# EAGLE design pcb (EAGLE 9.6.2)
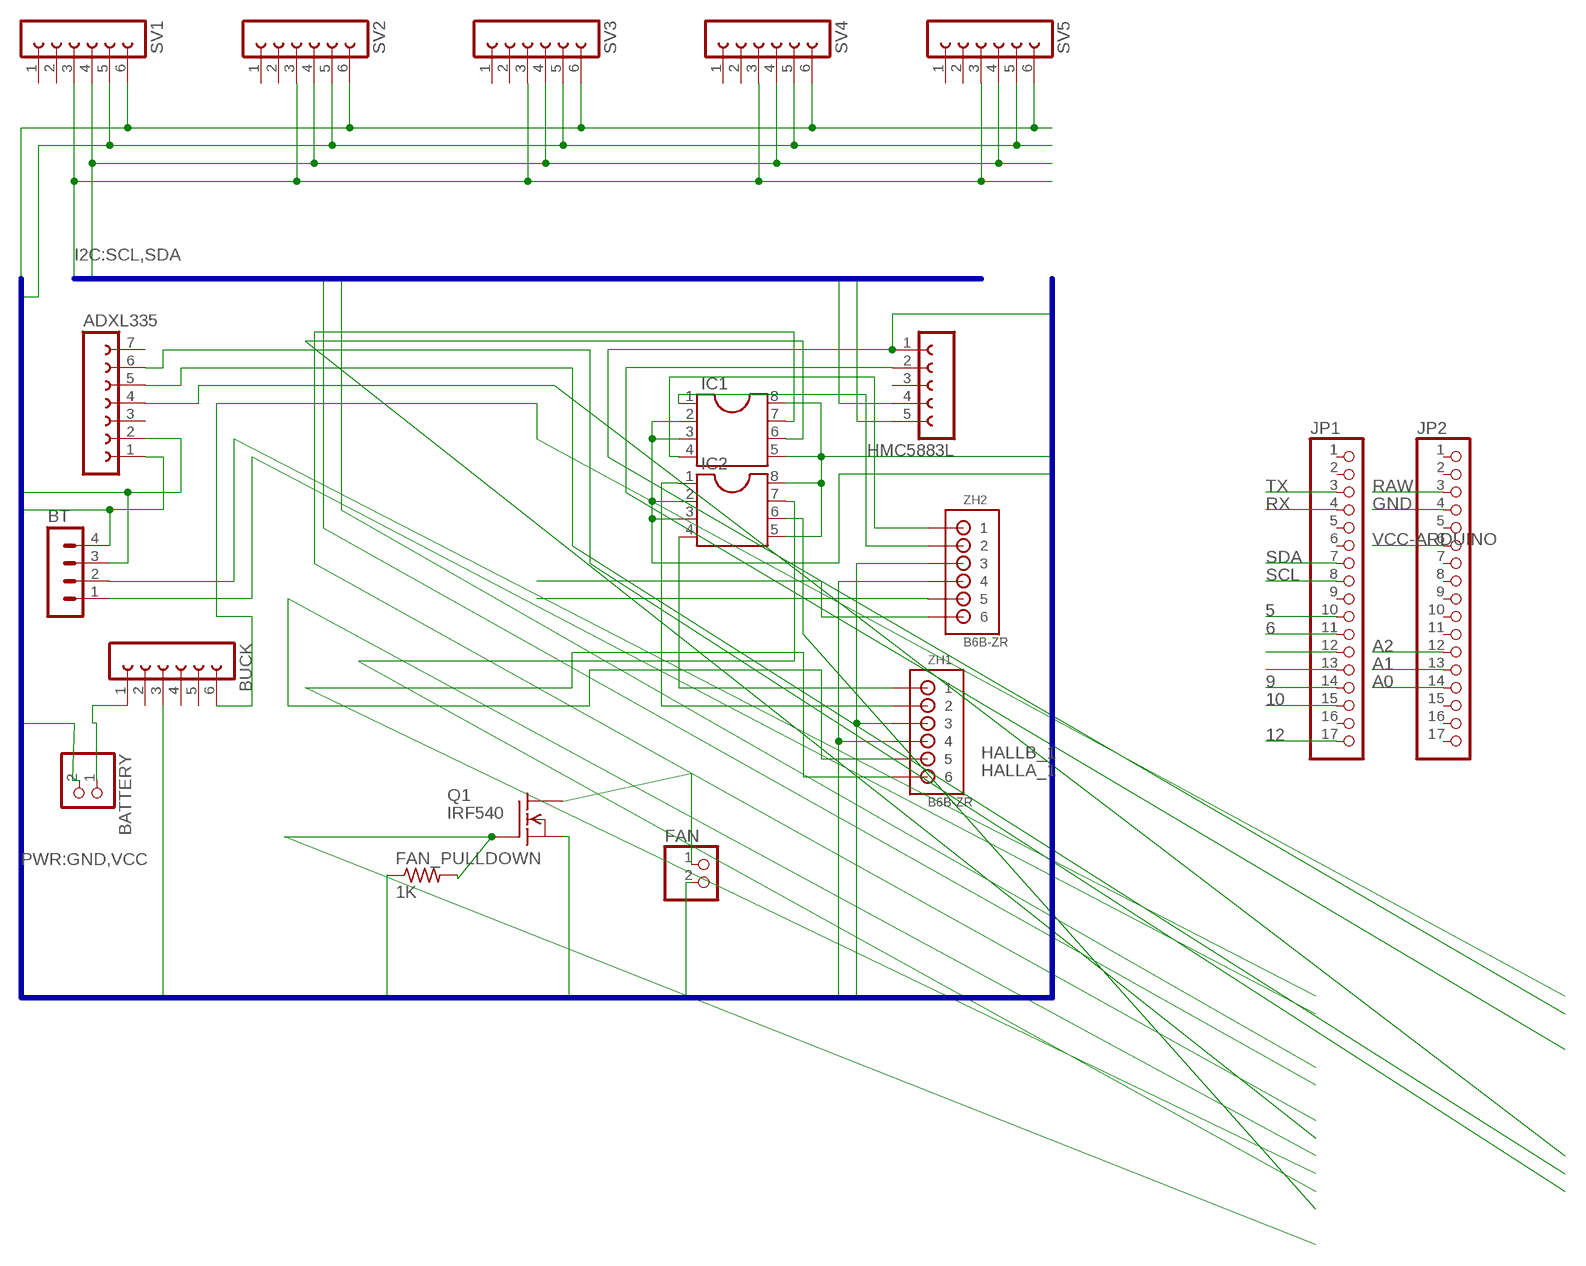
[diagram p0: schematic, sheet 1]

## Parts
ADXL335  FE07-1  [FE07]
BATTERY  PINHD-1X2  [1X02]
BT  MA04-1  [MA04-1]
BUCK  FE06-1  [FE06]
FAN  PINHD-1X2  [1X02]
FAN_PULLDOWN  1K  R-US_0207/10  [0207/10]
HMC5883L  FE05-1  [FE05-1]
IC1  DIL8S  [SOCKET-08]
IC2  DIL8S  [SOCKET-08]
JP1  PINHD-1X17  [1X17]
JP2  PINHD-1X17  [1X17]
Q1  IRF540  [TO220]
SV1  FE06-1  [FE06]
SV2  FE06-1  [FE06]
SV3  FE06-1  [FE06]
SV4  FE06-1  [FE06]
SV5  FE06-1  [FE06]
ZH1  B6B-ZR  [B6B-ZR]
ZH2  B6B-ZR  [B6B-ZR]

## Nets
5: IC1.7 JP1.10
6: IC1.6 JP1.11
9: IC2.7 JP1.14
10: IC2.6 JP1.15
12: FAN_PULLDOWN.2 JP1.17 Q1.1(G)
A0: ADXL335.6 JP2.14
A1: ADXL335.5 JP2.13
A2: ADXL335.4 JP2.12
GND: ADXL335.2 BATTERY.2 BT.3 BUCK.3 FAN_PULLDOWN.1 HMC5883L.1 IC1.5 IC1.8 IC2.5 IC2.8 JP2.4 Q1.3(S) SV1.5 SV2.5 SV3.5 SV4.5 SV5.5 ZH1.4 ZH2.4
HALLA_1: JP1.13 ZH1.6
HALLB_1: JP1.12 ZH1.5
N$7: BATTERY.1 BUCK.1
N$11: ZH2.5
N$12: ZH2.6
N$13: IC1.1 ZH2.2
N$14: IC1.4 ZH2.1
N$15: IC2.4 ZH1.1
N$16: IC2.1 ZH1.2
N$18: FAN.1 Q1.2(D)
RAW: BUCK.6 JP2.3
RX: BT.1 JP1.4
SCL: HMC5883L.4 JP1.8 SV1.4 SV2.4 SV3.4 SV4.4 SV5.4
SDA: HMC5883L.5 JP1.7 SV1.3 SV2.3 SV3.3 SV4.3 SV5.3
TX: BT.2 JP1.3
VCC: ADXL335.1 BT.4 FAN.2 IC1.2 IC1.3 IC2.2 IC2.3 SV1.6 SV2.6 SV3.6 SV4.6 SV5.6 ZH1.3 ZH2.3
VCC-ARDUINO: HMC5883L.2 JP2.6
Unconnected: ADXL335.3 ADXL335.7 BUCK.2 BUCK.4 BUCK.5 HMC5883L.3 JP1.1 JP1.2 JP1.5 JP1.6 JP1.9 JP1.16 JP2.1 JP2.2 JP2.5 JP2.7 JP2.8 JP2.9 JP2.10 JP2.11 JP2.15 JP2.16 JP2.17 SV1.1 SV1.2 SV2.1 SV2.2 SV3.1 SV3.2 SV4.1 SV4.2 SV5.1 SV5.2

## Buses
I2C:SCL,SDA
PWR:GND,VCC

## Library data of the parts
ADXL335 = con-lsta:FE07-1: FEMALE HEADER; OC_FARNELL: unknown; OC_NEWARK: unknown
BATTERY FAN = pinhead:PINHD-1X2: PIN HEADER
BT = con-lstb:MA04-1: PIN HEADER; OC_FARNELL: unknown; OC_NEWARK: unknown
BUCK SV1-SV5 = con-lsta:FE06-1: FEMALE HEADER; OC_FARNELL: unknown; OC_NEWARK: unknown
FAN_PULLDOWN = rcl:R-US_: RESISTOR, American symbol; SPICEPREFIX: R
HMC5883L = con-lsta:FE05-1: FEMALE HEADER; OC_FARNELL: unknown; OC_NEWARK: unknown
IC1 IC2 = ic-package:DIL8: Dual In Line / Socket
JP1 JP2 = pinhead:PINHD-1X17: PIN HEADER
Q1 = transistor-fet:IRF540: N-Channel Enhancement MOSFET (HEXFET); 100V; 28A; 0,077Ohm
ZH1 ZH2 = JST ZH:B6B-ZR: JST-ZH Connector 6 pol, 1.5mm pitch Package: B6B-ZR Source: http://www.jst-mfg.com/product/pdf/eng/eZH.pdf

## Board
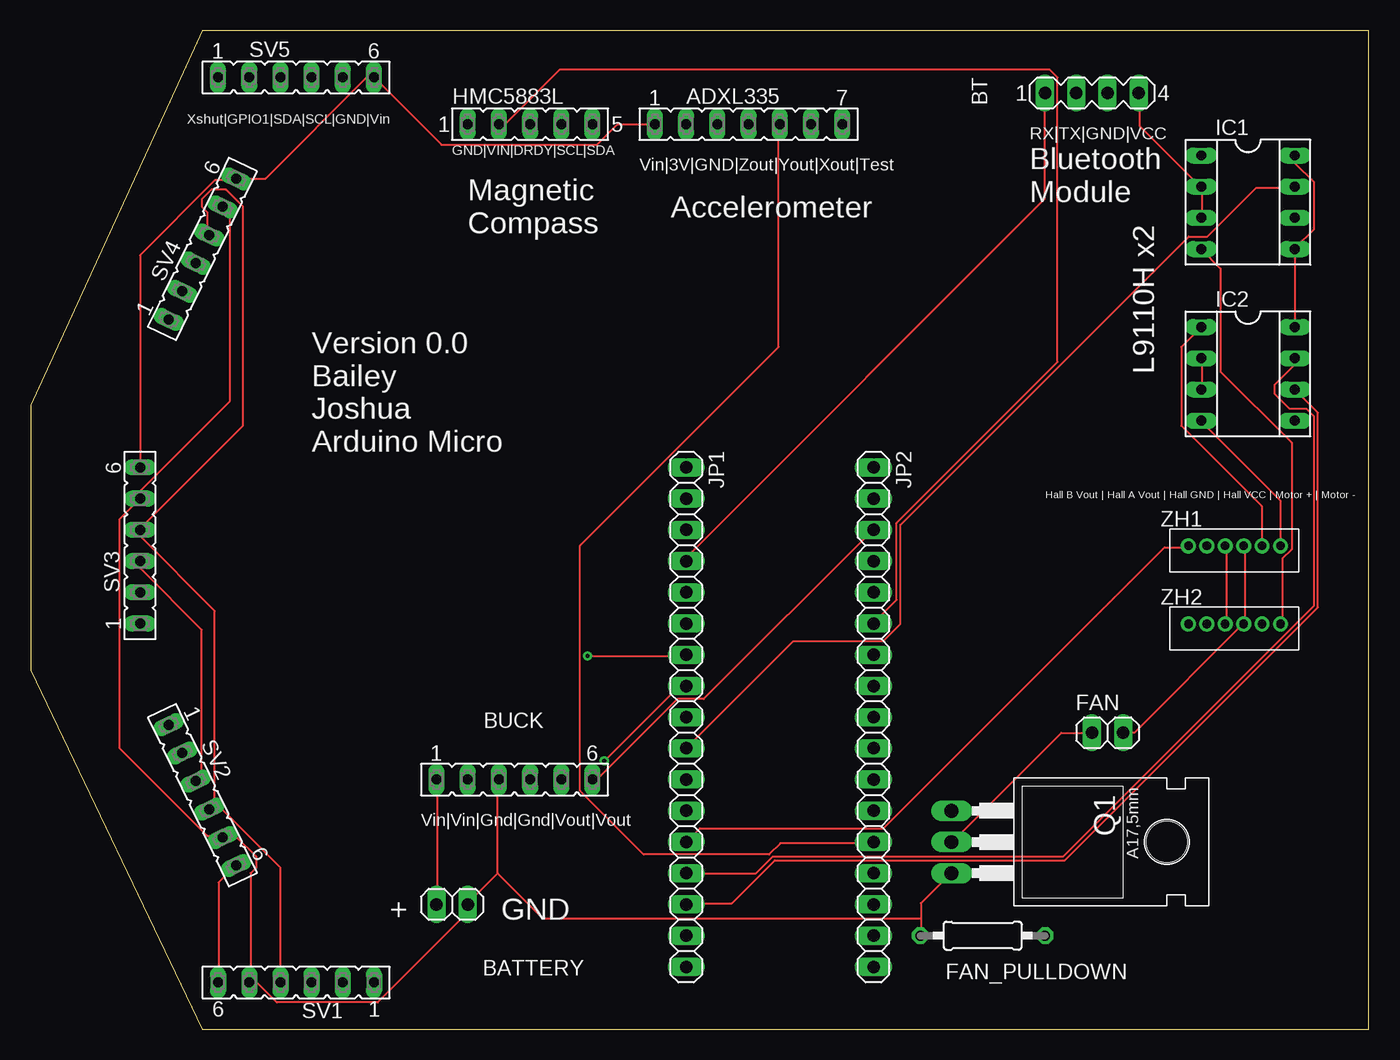
[diagram p1: board, top side]
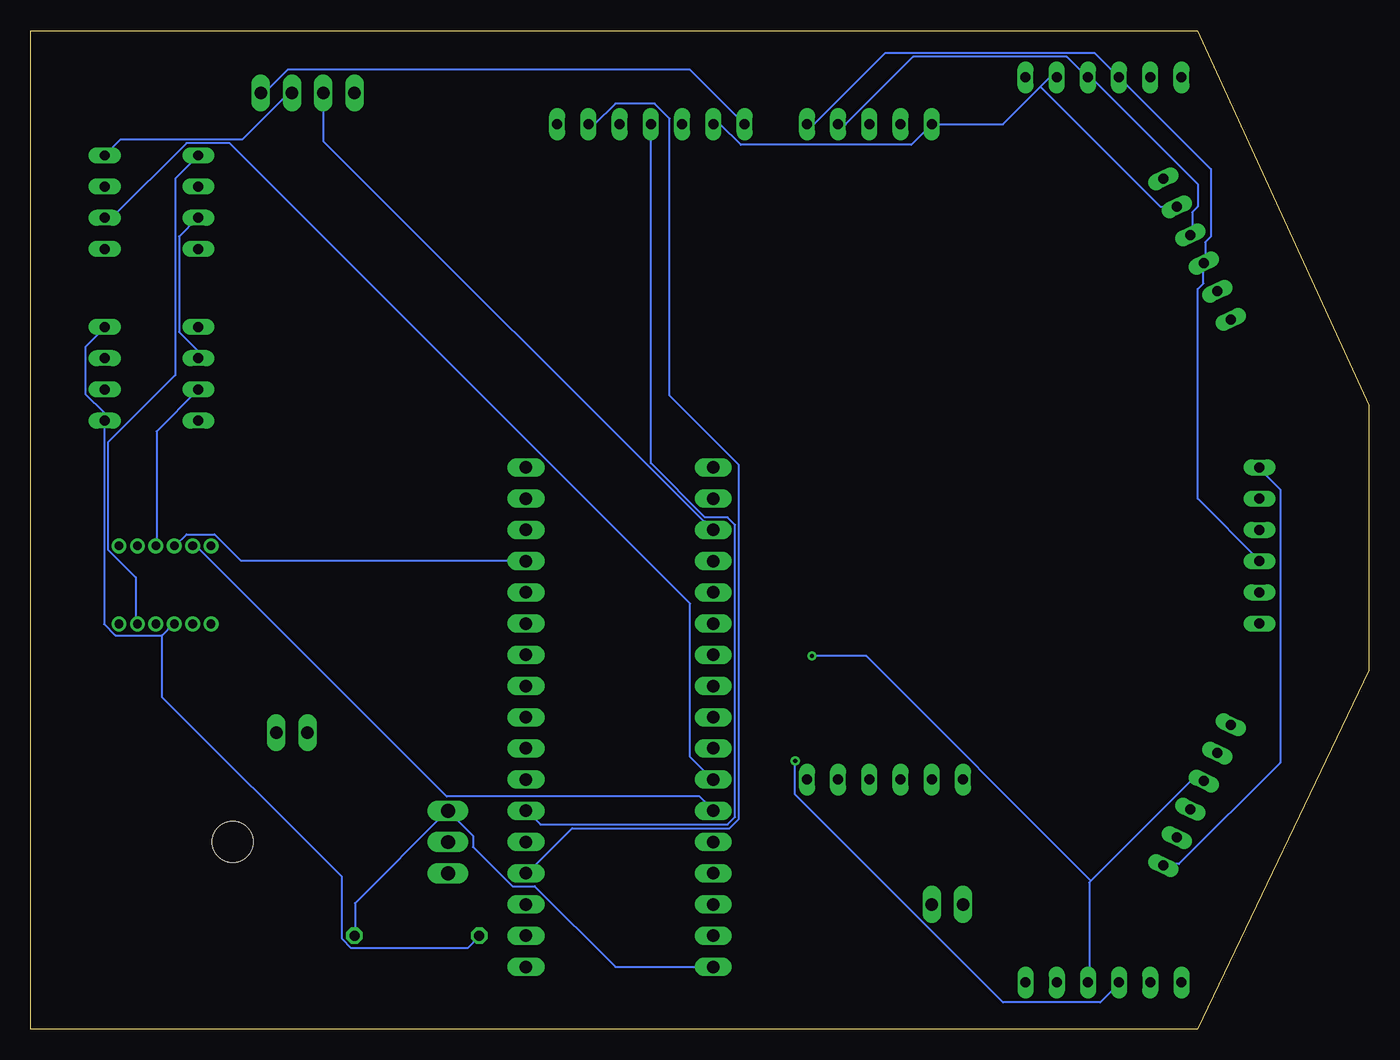
[diagram p2: board, bottom side, seen from below]

Size 108.89 x 81.27 mm. Coordinates in mm from the lower left corner, seen from the top.
Outline: 13.97,0 108.89,0 108.89,81.27 13.96,81.27 0,50.8 0,29.21 13.97,0
Copper layers (1*16): Top 0.035mm / dielectric 1.5mm / Bottom 0.035mm
Design rules "default": minimum track width 6mil, minimum drill 0.35mm, track to track 6mil, track to pad 6mil, pad to pad 6mil, via to via 6mil, smd to smd 6mil, copper to edge 40mil, drill to drill 6mil, minimum pad ring 10mil, minimum via ring 8mil, stop-mask expansion 4mil, vias tented up to drill 0mil, thermal gap 10mil

### Footprints (pad centres in the part's own frame; a part is rotated, then mirrored left to right if it is on the bottom)
FE07 = drill 0.813 long: 1 -7.62,0; 2 -5.08,0; 3 -2.54,0; 4 0,0; 5 2.54,0; 6 5.08,0; 7 7.62,0
1X02 = drill 1.016 long: 1 -1.27,0; 2 1.27,0
MA04-1 = drill 1.016 long: 1 -3.81,0; 2 -1.27,0; 3 1.27,0; 4 3.81,0
FE06 = drill 0.813 long: 1 -6.35,0; 2 -3.81,0; 3 -1.27,0; 4 1.27,0; 5 3.81,0; 6 6.35,0
0207/10 = drill 0.813 octagon: 1 -5.08,0; 2 5.08,0
FE05-1 = drill 0.813 long: 1 -5.08,0; 2 -2.54,0; 3 0,0; 4 2.54,0; 5 5.08,0
SOCKET-08 = drill 0.813 long: 1 -3.81,-3.81; 2 -1.27,-3.81; 3 1.27,-3.81; 4 3.81,-3.81; 5 3.81,3.81; 6 1.27,3.81; 7 -1.27,3.81; 8 -3.81,3.81
1X17 = drill 1.016 long: 1 -20.32,0; 2 -17.78,0; 3 -15.24,0; 4 -12.7,0; 5 -10.16,0; 6 -7.62,0; 7 -5.08,0; 8 -2.54,0; 9 0,0; 10 2.54,0; 11 5.08,0; 12 7.62,0; 13 10.16,0; 14 12.7,0; 15 15.24,0; 16 17.78,0; 17 20.32,0
TO220 = drill 1.118 long: 1 -2.54,-6.35; 2 0,-6.35; 3 2.54,-6.35 | hole 3.302: 0,11.176
B6B-ZR = drill 0.7: 1 9,-1.3; 2 7.5,-1.3; 3 6,-1.3; 4 4.5,-1.3; 5 3,-1.3; 6 1.5,-1.3

### Placement (x,y rotation side)
ADXL335  58.42,73.66 0 top
BATTERY  34.29,10.16 0 top
BT  86.36,76.2 0 top
BUCK  39.37,20.32 0 top
FAN  87.63,24.13 0 top
FAN_PULLDOWN  77.47,7.62 0 top
HMC5883L  40.64,73.66 0 top
IC1  99.06,67.31 270 top
IC2  99.06,53.34 270 top
JP1  53.34,25.4 270 top
JP2  68.58,25.4 270 top
Q1  81.28,15.24 270 top
SV1  21.59,3.81 180 top
SV2  13.97,19.05 295.6 top
SV3  8.89,39.37 90 top
SV4  13.97,63.5 64.4 top
SV5  21.59,77.47 0 top
ZH1  92.71,40.64 0 top
ZH2  92.71,34.29 0 top

### Tracks (layer width: path | path; a pad name or v marks a point on that pad's centre or on a via)
5
  Top 0.152: JP1.10 62.08,31.6 69.39,31.6 70.76,32.97 70.76,41.05 94.23,64.52 95.76,64.52 99.72,68.48 102.77,68.48 IC1.7
6
  Bottom 0.152: IC1.6 102.31,66.04 96.22,72.14 92.71,72.14 55.22,34.65 55.22,22.15 53.39,20.32 JP1.11
9
  Top 0.152: JP1.14 59.03,12.7 60.4,14.07 84.02,14.07 104.45,34.49 104.45,49.89 103.83,50.5 102.46,50.5 101.24,51.71 101.24,52.48 102.77,54 102.77,54.61 IC2.7
10
  Top 0.152: IC2.6 104.75,50.19 104.75,34.34 84.18,13.77 60.55,13.77 57.05,10.26 53.39,10.26 JP1.15
12
  Bottom 0.152: FAN_PULLDOWN.2 82.5,7.67 82.5,10.26 75.03,17.73 Q1.1 72.9,15.75 72.9,14.83 69.7,11.63 67.87,11.63 61.32,5.08 JP1.17
A0
  Bottom 0.152: ADXL335.6 62.99,73.66 61.32,75.34 58.12,75.34 56.9,74.12 56.9,51.56 51.26,45.92 51.26,17.12 52.02,16.36 64.82,16.36 68.48,12.7 JP2.14
A1
  Top 0.152: ADXL335.5 60.86,73.66 60.86,55.52 44.7,39.37 44.7,19.41 49.89,14.22 60.1,14.22 61.01,15.14 68.48,15.14 JP2.13
A2
  Bottom 0.152: ADXL335.4 58.42,46.08 54,41.66 52.17,41.66 51.56,41.05 51.56,17.27 52.17,16.66 67.41,16.66 68.48,17.73 JP2.12
GND
  Top 0.152: ZH2.4 97.28,33.12 97.28,39.22 ZH1.4 | IC2.8 102.92,57.2 102.92,63.45 IC1.5 102.92,63.6 104.45,65.13 104.45,68.94 102.92,70.46 102.92,71.07 IC1.8 | 72.44,9.04 72.44,10.26 74.88,12.7 Q1.3 | 72.44,9.04 72.44,7.67 FAN_PULLDOWN.1 | 38,12.7 38,20.32 BUCK.3 | 38,12.7 35.56,10.26 BATTERY.2 35.56,9.5 28.25,2.18 20.02,2.18 18.49,3.71 17.88,3.71 SV1.5 17.88,3.86 17.88,12.7 18.34,13.16 18.34,14.07 16.82,15.6 15.75,15.6 SV2.5 15.6,15.75 14.38,15.75 7.21,22.91 7.21,41.5 SV3.5 8.89,43.79 16.21,51.11 16.21,66.34 15.75,66.8 SV4.5 | 72.44,9.04 41.66,9.04 38,12.7
  Bottom 0.152: JP2.4 68.63,38.15 91.8,38.15 93.93,40.28 96.22,40.28 97.13,39.37 ZH1.4 | IC2.8 102.92,57.05 104.45,55.52 104.45,51.71 102.92,50.19 102.92,49.58 IC2.5 102.92,49.43 102.92,32.97 102.01,32.05 98.2,32.05 | IC1.8 101.55,72.44 91.64,72.44 87.99,76.1 87.68,76.1 BT.3 | 98.2,32.05 97.28,32.97 ZH2.4 | SV5.5 25.96,77.47 26.72,76.71 | 26.72,76.71 29.77,73.66 HMC5883L.1 37.24,71.98 51.11,71.98 52.78,73.66 ADXL335.2 | 26.72,76.71 16.97,66.95 15.75,66.95 SV4.5 | 98.2,32.05 98.2,27.03 83.57,12.39 83.57,7.37 82.8,6.6 73.36,6.6 72.44,7.52 FAN_PULLDOWN.1
HALLA_1
  Top 0.152: JP1.13 54.46,16.36 69.39,16.36 92.25,39.22 94.08,39.22 ZH1.6
HALLB_1
  Bottom 0.152: ZH1.5 95.61,39.22 95.3,39.22 75.03,18.95 54.46,18.95 53.39,17.88 JP1.12
N$7
  Top 0.152: BUCK.1 33.12,20.32 33.12,10.26 BATTERY.1
N$13
  Bottom 0.152: IC1.1 97.13,69.24 97.13,53.24 102.62,47.75 102.62,39.07 100.33,36.78 100.33,33.12 ZH2.2
N$14
  Top 0.152: IC1.4 96.83,61.93 96.83,53.54 102.62,47.75 102.62,39.07 101.85,38.3 101.85,33.12 ZH2.1
N$15
  Top 0.152: ZH1.1 101.7,39.37 101.7,43.03 95.3,49.43 IC2.4
N$16
  Top 0.152: IC2.1 93.62,55.52 93.62,49.12 100.18,42.57 100.18,39.37 ZH1.2
N$18
  Top 0.152: FAN.1 83.87,24.13 75.03,15.29 Q1.2
RAW
  Top 0.152: BUCK.6 46.08,20.32 52.63,26.87 54.76,26.87 68.48,40.59 JP2.3
RX
  Top 0.152: JP1.4 53.39,38.15 53.39,38.46 82.5,67.56 82.5,76.1 BT.1
SCL  (via drill 0.35)
  Top 0.152: 14.99,17.88 15.6,17.88 20.32,13.16 SV1.4 | 14.99,17.88 14.53,17.88 SV2.4 14.99,17.88 | 14.99,17.88 14.99,34.04 8.89,40.13 SV3.4 8.89,40.74 17.27,49.12 17.27,66.95 15.9,68.33 14.68,68.33 13.92,67.56 13.92,66.95 14.38,66.5 14.38,64.67 SV4.4 | JP1.8 52.78,27.94 v46.69,21.84
  Bottom 0.152: SV4.4 14.38,64.67 14.38,66.5 13.92,66.95 13.92,68.78 22.61,77.47 SV5.4 22.91,77.47 24.59,79.15 37.08,79.15 42.57,73.66 HMC5883L.4 | v46.69,21.84 46.69,19.1 29.77,2.18 21.84,2.18 20.32,3.71 SV1.4
SDA  (via drill 0.35)
  Top 0.152: SV3.3 8.89,37.54 13.92,32.51 13.92,20.78 13.46,20.32 SV2.3 | v45.31,30.38 53.24,30.38 JP1.7
  Bottom 0.152: HMC5883L.5 45.16,73.66 39.37,79.45 22.3,79.45 SV5.3 12.85,70 12.85,64.52 13.31,64.06 13.31,62.38 SV4.3 13.46,62.23 13.46,60.71 13.92,60.25 13.92,43.18 8.89,38.15 SV3.3 | 22.61,12.09 14.53,20.17 13.46,20.17 SV2.3 | 22.61,12.09 22.76,11.94 22.76,3.86 SV1.3 | v45.31,30.38 40.89,30.38 22.61,12.09
TX
  Bottom 0.152: BT.2 85.09,72.29 54.15,41.35 54,41.35 53.39,40.74 JP1.3
VCC
  Top 0.152: ZH1.3 98.81,39.22 98.81,33.12 ZH2.3 98.65,32.97 89.81,24.13 FAN.2 | IC2.3 95.3,52.17 95.3,54.61 IC2.2 | IC1.3 95.3,66.04 95.3,68.48 IC1.2 95.15,68.63 90.27,73.51 90.27,76.1 BT.4 | SV1.6 15.29,3.86 15.29,11.94 16.66,13.31 SV2.6 | SV3.6 8.89,62.99 14.99,69.09 16.66,69.09 SV4.6 16.82,69.24 19.1,69.24 27.33,77.47 SV5.6 33.43,71.98 46.08,71.98 47.75,73.66 ADXL335.1
  Bottom 0.152: IC2.2 95.3,54.61 95.3,55.22 96.83,56.74 96.83,64.52 95.3,66.04 IC1.3 | IC2.3 98.65,48.67 98.65,39.37 ZH1.3 | SV2.6 16.66,13.46 15.44,13.46 7.21,21.69 7.21,43.94 8.89,45.62 SV3.6 | ADXL335.1 55.22,78.08 87.99,78.08 89.81,76.25 90.12,76.25 BT.4
VCC-ARDUINO
  Top 0.152: HMC5883L.2 38.61,73.66 43.03,78.08 82.96,78.08 83.57,77.47 83.57,54.3 70.46,41.2 70.46,34.95 68.63,33.12 JP2.6

### Text on the board
tPlace: Xshut|GPIO1|SDA|SCL|GND|Vin | RX|TX|GND|VCC | GND|VIN|DRDY|SCL|SDA | Vin|3V|GND|Zout|Yout|Xout|Test | Bluetooth / Module | Accelerometer | Magnetic / Compass | L9110H x2 | Version 0.0 / Bailey / Joshua / Arduino Micro | Hall B Vout | Hall A Vout | Hall GND | Hall VCC | Motor + | Motor - | Vin|Vin|Gnd|Gnd|Vout|Vout | + GND